# EasyEDA Pro project ProPrj_measure_boardd_2025-02-12.epro

# Schematic Schematic1
Board Name: Board1; Create Date: 2025-02-12; Page Name: P1; Project Name: measure_boardd; Schematic Name: Schematic1; Update Date: 2025-02-12; Company: EasyEDA.com; Page Size: A4; Version: V1.0
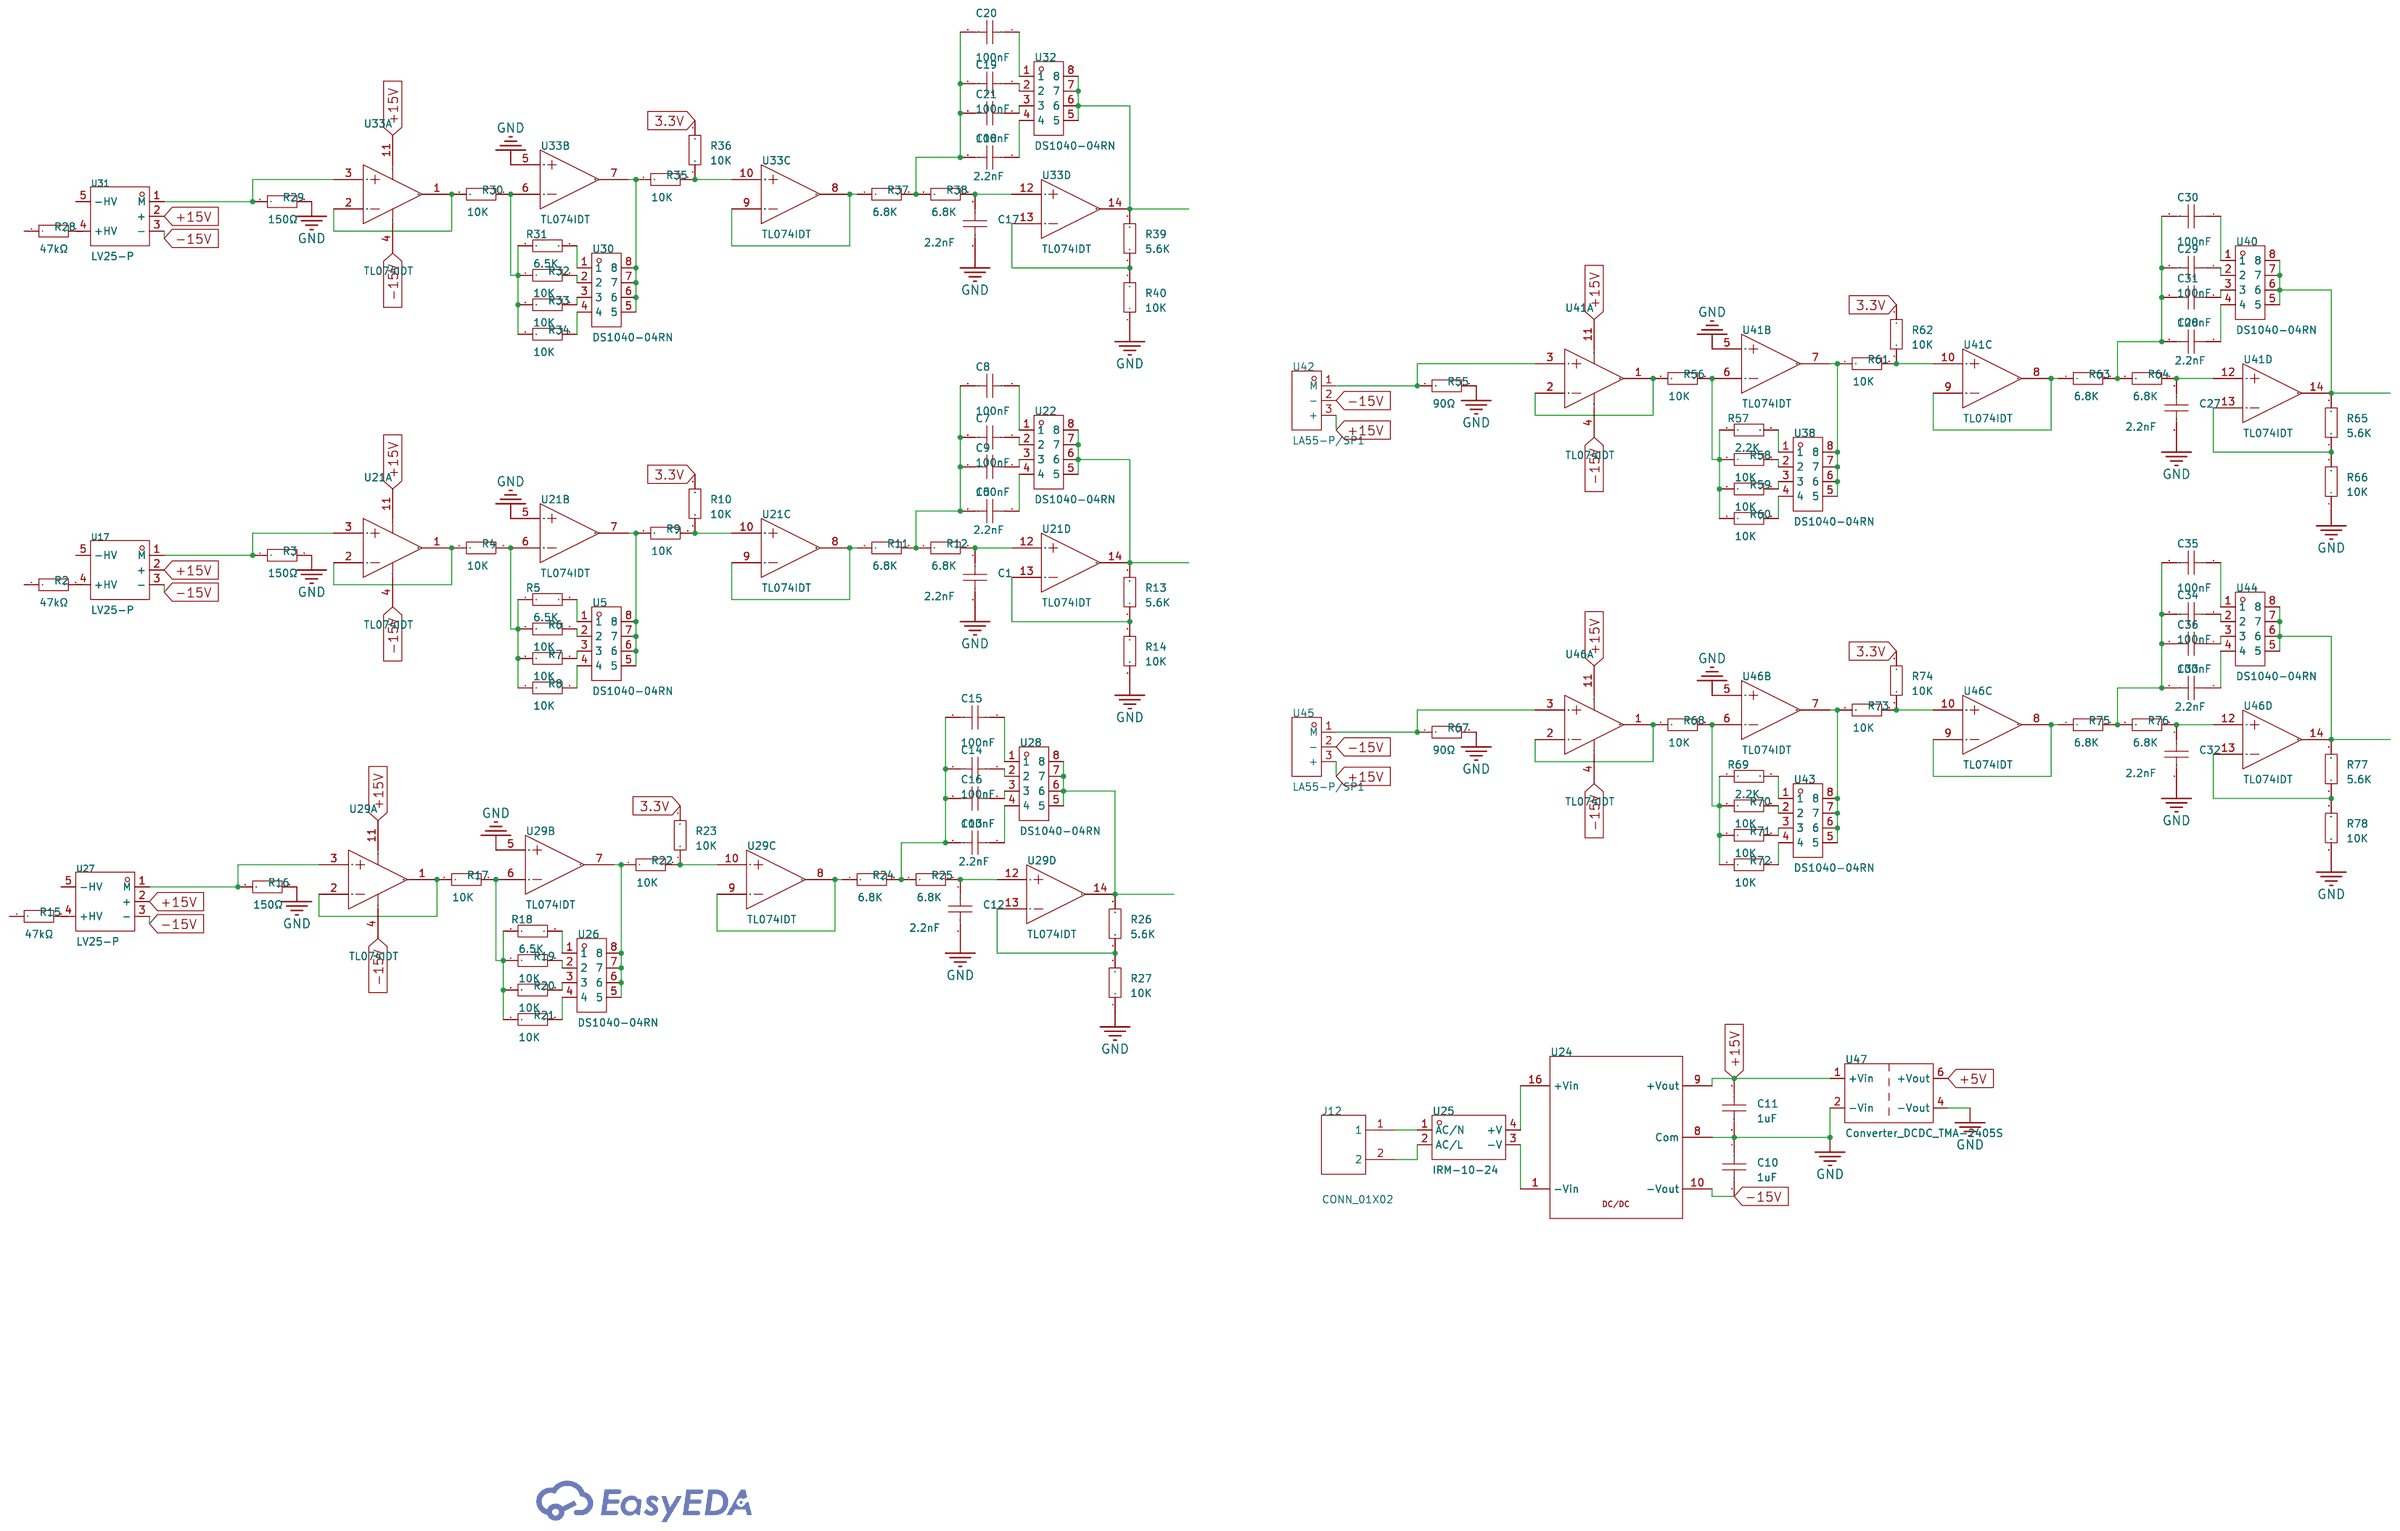
[diagram p0: schematic sheet]

## Parts
C1  2.2nF  [C0805]
C5  2.2nF  [C0805]
C7  100nF  [C0805]
C8  100nF  [C0805]
C9  100nF  [C0805]
C10  1uF  [C0805]
C11  1uF  [C0805]
C12  2.2nF  [C0805]
C13  2.2nF  [C0805]
C14  100nF  [C0805]
C15  100nF  [C0805]
C16  100nF  [C0805]
C17  2.2nF  [C0805]
C18  2.2nF  [C0805]
C19  100nF  [C0805]
C20  100nF  [C0805]
C21  100nF  [C0805]
C27  2.2nF  [C0805]
C28  2.2nF  [C0805]
C29  100nF  [C0805]
C30  100nF  [C0805]
C31  100nF  [C0805]
C32  2.2nF  [C0805]
C33  2.2nF  [C0805]
C34  100nF  [C0805]
C35  100nF  [C0805]
C36  100nF  [C0805]
J12  CONN_01X02  [CONN-TH_2P-P3.81_1727010]
R2  47kΩ  [RES-TH_BD8.0-L24.5-P28.50-D0.8]
R3  150Ω  [R_AXIAL-0.4]
R4  10K  [R0603]
R5  6.5K  [R0603]
R6  10K  [R0603]
R7  10K  [R0603]
R8  10K  [R0603]
R9  10K  [R0603]
R10  10K  [R0603]
R11  6.8K  [R0603]
R12  6.8K  [R0603]
R13  5.6K  [R0603]
R14  10K  [R0603]
R15  47kΩ  [RES-TH_BD8.0-L24.5-P28.50-D0.8]
R16  150Ω  [R_AXIAL-0.4]
R17  10K  [R0603]
R18  6.5K  [R0603]
R19  10K  [R0603]
R20  10K  [R0603]
R21  10K  [R0603]
R22  10K  [R0603]
R23  10K  [R0603]
R24  6.8K  [R0603]
R25  6.8K  [R0603]
R26  5.6K  [R0603]
R27  10K  [R0603]
R28  47kΩ  [RES-TH_BD8.0-L24.5-P28.50-D0.8]
R29  150Ω  [R_AXIAL-0.4]
R30  10K  [R0603]
R31  6.5K  [R0603]
R32  10K  [R0603]
R33  10K  [R0603]
R34  10K  [R0603]
R35  10K  [R0603]
R36  10K  [R0603]
R37  6.8K  [R0603]
R38  6.8K  [R0603]
R39  5.6K  [R0603]
R40  10K  [R0603]
R55  90Ω  [R_AXIAL-0.4]
R56  10K  [R0603]
R57  2.2K  [R0603]
R58  10K  [R0603]
R59  10K  [R0603]
R60  10K  [R0603]
R61  10K  [R0603]
R62  10K  [R0603]
R63  6.8K  [R0603]
R64  6.8K  [R0603]
R65  5.6K  [R0603]
R66  10K  [R0603]
R67  90Ω  [R_AXIAL-0.4]
R68  10K  [R0603]
R69  2.2K  [R0603]
R70  10K  [R0603]
R71  10K  [R0603]
R72  10K  [R0603]
R73  10K  [R0603]
R74  10K  [R0603]
R75  6.8K  [R0603]
R76  6.8K  [R0603]
R77  5.6K  [R0603]
R78  10K  [R0603]
U5  DS1040-04RN  [KEY-TH_DS1040-04RN]
U17  LV25-P  [SENSOR-TH_LV25-P]
U21  TL074IDT  [SOIC-14_L8.7-W3.9-P1.27-LS6.0-BL]  (sections 1,2,3,4)
U22  DS1040-04RN  [KEY-TH_DS1040-04RN]
U24  -  [TEL_8_SERIES]
U25  IRM-10-24  [PWRM-TH_4P-L45.7-W25.4-P8.0]
U26  DS1040-04RN  [KEY-TH_DS1040-04RN]
U27  LV25-P  [SENSOR-TH_LV25-P]
U28  DS1040-04RN  [KEY-TH_DS1040-04RN]
U29  TL074IDT  [SOIC-14_L8.7-W3.9-P1.27-LS6.0-BL]  (sections 1,2,3,4)
U30  DS1040-04RN  [KEY-TH_DS1040-04RN]
U31  LV25-P  [SENSOR-TH_LV25-P]
U32  DS1040-04RN  [KEY-TH_DS1040-04RN]
U33  TL074IDT  [SOIC-14_L8.7-W3.9-P1.27-LS6.0-BL]  (sections 1,2,3,4)
U38  DS1040-04RN  [KEY-TH_DS1040-04RN]
U40  DS1040-04RN  [KEY-TH_DS1040-04RN]
U41  TL074IDT  [SOIC-14_L8.7-W3.9-P1.27-LS6.0-BL]  (sections 1,2,3,4)
U42  LA55-P/SP1  [SENSOR-TH_LAXX-P]
U43  DS1040-04RN  [KEY-TH_DS1040-04RN]
U44  DS1040-04RN  [KEY-TH_DS1040-04RN]
U45  LA55-P/SP1  [SENSOR-TH_LAXX-P]
U46  TL074IDT  [SOIC-14_L8.7-W3.9-P1.27-LS6.0-BL]  (sections 1,2,3,4)
U47  TMA-2405S  [Converter_DCDC:Converter_DCDC_TRACO_TMA-15xxS_24xxS_Single_THT]

## Library data of the parts
C1 C5 C7-C21 C27-C36 = CAP_0805: Supplier Footprint: 0805
J12 = 1727010: Structure:1x2P Pitch:3.81mm Color:Green Mounting Style:Straight Current Rating (Max):13.5A Voltage Rating (Max):300V Number of Pins:2P Number of Rows:1 Wire Gauge - AWG:16~30 Wire Gauge - AWG:16~30 Number of PINs Per Row:2 Operating Temperature Range:- Op; LCSC Part Name: 3.81mm 1x2P 排数:1 每排P数:2 直插; Supplier Part: C89123; Manufacturer: Phoenix Contact(菲尼克斯); Supplier Footprint: 插件,P=3.81mm; JLCPCB Part Class: Extended Part; Datasheet: https://atta.szlcsc.com/upload/public/pdf/source/20161226/1482720147791.pdf; Supplier: LCSC; Structure: 1x2P; Pitch: 3.81mm; Color: Green; Mounting Style: Straight; Current Rating (Max): 13.5A; Voltage Rating (Max): 300V; Number of Pins: 2P; Number of Rows: 1; Wire Gauge - AWG: 16~30; Number of PINs Per Row: 2
R2 R15 R28 = Res_AXIAL-5W: Supplier Footprint: Through
R3 R16 R29 R55 R67 = Res_AXIAL-1/4W: Supplier Footprint: Through
R4-R14 R17-R27 R30-R40 R56-R66 R68-R78 = Res_0603: Supplier Footprint: 0603
U5 U22 U26 U28 U30 U32 U38 U40 U43 U44 = DS1040-04RN: Number of Positions:4Bit Lead Pitch:2.54mm Color:Red; Supplier Part: C3024970; Manufacturer: CONNFLY; Supplier Footprint: 插件; JLCPCB Part Class: Extended Part; Datasheet: https://atta.szlcsc.com/upload/public/pdf/source/20220524/E487E22DEF95345BB2C3C9897C5E0C2D.pdf; Supplier: LCSC; Number of Positions: 4Bit; Lead Pitch: 2.54mm; Color: Red
U17 U27 U31 = LV25-P: Supplier Part: C453476; Manufacturer: LEM(莱姆); Supplier Footprint: 插件; JLCPCB Part Class: Extended Part; Datasheet: https://atta.szlcsc.com/upload/public/pdf/source/20200901/C453476_5BA3BC4F59636857A644FEC5A2FF2FFA.pdf; Supplier: LCSC
U21 U29 U33 U41 U46 = TL074IDT: Number of Circuits:Quad Gain Bandwidth Product(GBP):3MHz Current - Input Bias(Ib):20pA Voltage - Input Offset(Vos):3mV Slew Rate(SR):13V/us Supply Current Per Channel:1.4mA Operating Temperature:-40℃~+105℃ Operating Temperature:-40℃~+105℃; Supplier Part: C107644; Manufacturer: ST(意法半导体); Supplier Footprint: SOIC-14; JLCPCB Part Class: Extended Part; Datasheet: https://atta.szlcsc.com/upload/public/pdf/source/20180511/C79668_B9AF02D8BC6CC04960E26C1CA949D7C5.pdf; Supplier: LCSC; Number of Circuits: Quad; Gain Bandwidth Product(GBP): 3MHz; Current - Input Bias(Ib): 20pA; Voltage - Input Offset(Vos): 3mV; Slew Rate(SR): 13V/us; Supply Current Per Channel: 1.4mA; Operating Temperature: -40℃~+105℃
U24 = TEL_8-2423
U25 = IRM-10-24_C5127809: LCSC Part Name: 10W AC-DC PCB安装绿色电源模块; Supplier Part: C5127809; Manufacturer: MW(明纬); JLCPCB Part Class: Extended Part; Datasheet: https://atta.szlcsc.com/upload/public/pdf/source/20230606/066C111D5DF9FD91D802111A052DE616.pdf; Supplier: LCSC
U42 U45 = LA55-P/SP1: Supplier Part: C454751; Manufacturer: LEM(莱姆); Supplier Footprint: 插件; JLCPCB Part Class: Extended Part; Supplier: LCSC
U47 = Converter_DCDC_TMA-2405S: User doc link: https://www.tracopower.com/products/tma.pdf

## Nets
3.3V: R10.2 R23.2 R36.2 R62.2 R74.2
+5V: U47.6(+Vout)
+15V: C11.1 U17.2(+) U21.11(VCC-) U24.9(+Vout) U27.2(+) U29.11(VCC-) U31.2(+) U33.11(VCC-) U41.11(VCC-) U42.3(+) U45.3(+) U46.11(VCC-) U47.1(+Vin)
-15V: C10.2 U17.3(-) U21.4(VCC+) U24.10(-Vout) U27.3(-) U29.4(VCC+) U31.3(-) U33.4(VCC+) U41.4(VCC+) U42.2(-) U45.2(-) U46.4(VCC+)
GND: C1.2 C10.1 C11.2 C12.2 C17.2 C27.2 C32.2 R3.2 R14.1 R16.2 R27.1 R29.2 R40.1 R55.2 R66.1 R67.2 R78.1 U21.5(2IN+) U24.8(Com) U29.5(2IN+) U33.5(2IN+) U41.5(2IN+) U46.5(2IN+) U47.2(-Vin) U47.4(-Vout)
Net-(C1-1): C1.1 R12.2 U21.12(4IN+)
Net-(C5-1): C5.1 U22.4
Net-(C5-2): C5.2 C7.2 C8.2 C9.2 R11.2 R12.1
Net-(C7-1): C7.1 U22.2
Net-(C8-1): C8.1 U22.1
Net-(C9-1): C9.1 U22.3
Net-(C12-1): C12.1 R25.2 U29.12(4IN+)
Net-(C13-1): C13.1 U28.4
Net-(C13-2): C13.2 C14.2 C15.2 C16.2 R24.2 R25.1
Net-(C14-1): C14.1 U28.2
Net-(C15-1): C15.1 U28.1
Net-(C16-1): C16.1 U28.3
Net-(C17-1): C17.1 R38.2 U33.12(4IN+)
Net-(C18-1): C18.1 U32.4
Net-(C18-2): C18.2 C19.2 C20.2 C21.2 R37.2 R38.1
Net-(C19-1): C19.1 U32.2
Net-(C20-1): C20.1 U32.1
Net-(C21-1): C21.1 U32.3
Net-(C27-1): C27.1 R64.2 U41.12(4IN+)
Net-(C28-1): C28.1 U40.4
Net-(C28-2): C28.2 C29.2 C30.2 C31.2 R63.2 R64.1
Net-(C29-1): C29.1 U40.2
Net-(C30-1): C30.1 U40.1
Net-(C31-1): C31.1 U40.3
Net-(C32-1): C32.1 R76.2 U46.12(4IN+)
Net-(C33-1): C33.1 U44.4
Net-(C33-2): C33.2 C34.2 C35.2 C36.2 R75.2 R76.1
Net-(C34-1): C34.1 U44.2
Net-(C35-1): C35.1 U44.1
Net-(C36-1): C36.1 U44.3
Net-(J12-1): J12.1 U25.1(AC/N)
Net-(J12-2): J12.2 U25.2(AC/L)
Net-(R2-2): R2.2 U17.4(+HV)
Net-(R3-1): R3.1 U17.1(M) U21.3(1IN+)
Net-(R4-1): R4.1 U21.1(1OUT) U21.2(1IN-)
Net-(R4-2): R4.2 R5.1 R6.1 R7.1 R8.1 U21.6(2IN-)
Net-(R5-2): R5.2 U5.1
Net-(R6-2): R6.2 U5.2
Net-(R7-2): R7.2 U5.3
Net-(R8-2): R8.2 U5.4
Net-(R9-1): R9.1 U5.5 U5.6 U5.7 U5.8 U21.7(2OUT)
Net-(R9-2): R9.2 R10.1 U21.10(3IN+)
Net-(R11-1): R11.1 U21.8(3OUT) U21.9(3IN-)
Net-(R13-1): R13.1 R14.2 U21.13(4IN-)
Net-(R13-2): R13.2 U21.14(4OUT) U22.5 U22.6 U22.7 U22.8
Net-(R15-2): R15.2 U27.4(+HV)
Net-(R16-1): R16.1 U27.1(M) U29.3(1IN+)
Net-(R17-1): R17.1 U29.1(1OUT) U29.2(1IN-)
Net-(R17-2): R17.2 R18.1 R19.1 R20.1 R21.1 U29.6(2IN-)
Net-(R18-2): R18.2 U26.1
Net-(R19-2): R19.2 U26.2
Net-(R20-2): R20.2 U26.3
Net-(R21-2): R21.2 U26.4
Net-(R22-1): R22.1 U26.5 U26.6 U26.7 U26.8 U29.7(2OUT)
Net-(R22-2): R22.2 R23.1 U29.10(3IN+)
Net-(R24-1): R24.1 U29.8(3OUT) U29.9(3IN-)
Net-(R26-1): R26.1 R27.2 U29.13(4IN-)
Net-(R26-2): R26.2 U28.5 U28.6 U28.7 U28.8 U29.14(4OUT)
Net-(R28-2): R28.2 U31.4(+HV)
Net-(R29-1): R29.1 U31.1(M) U33.3(1IN+)
Net-(R30-1): R30.1 U33.1(1OUT) U33.2(1IN-)
Net-(R30-2): R30.2 R31.1 R32.1 R33.1 R34.1 U33.6(2IN-)
Net-(R31-2): R31.2 U30.1
Net-(R32-2): R32.2 U30.2
Net-(R33-2): R33.2 U30.3
Net-(R34-2): R34.2 U30.4
Net-(R35-1): R35.1 U30.5 U30.6 U30.7 U30.8 U33.7(2OUT)
Net-(R35-2): R35.2 R36.1 U33.10(3IN+)
Net-(R37-1): R37.1 U33.8(3OUT) U33.9(3IN-)
Net-(R39-1): R39.1 R40.2 U33.13(4IN-)
Net-(R39-2): R39.2 U32.5 U32.6 U32.7 U32.8 U33.14(4OUT)
Net-(R55-1): R55.1 U41.3(1IN+) U42.1(M)
Net-(R56-1): R56.1 U41.1(1OUT) U41.2(1IN-)
Net-(R56-2): R56.2 R57.1 R58.1 R59.1 R60.1 U41.6(2IN-)
Net-(R57-2): R57.2 U38.1
Net-(R58-2): R58.2 U38.2
Net-(R59-2): R59.2 U38.3
Net-(R60-2): R60.2 U38.4
Net-(R61-1): R61.1 U38.5 U38.6 U38.7 U38.8 U41.7(2OUT)
Net-(R61-2): R61.2 R62.1 U41.10(3IN+)
Net-(R63-1): R63.1 U41.8(3OUT) U41.9(3IN-)
Net-(R65-1): R65.1 R66.2 U41.13(4IN-)
Net-(R65-2): R65.2 U40.5 U40.6 U40.7 U40.8 U41.14(4OUT)
Net-(R67-1): R67.1 U45.1(M) U46.3(1IN+)
Net-(R68-1): R68.1 U46.1(1OUT) U46.2(1IN-)
Net-(R68-2): R68.2 R69.1 R70.1 R71.1 R72.1 U46.6(2IN-)
Net-(R69-2): R69.2 U43.1
Net-(R70-2): R70.2 U43.2
Net-(R71-2): R71.2 U43.3
Net-(R72-2): R72.2 U43.4
Net-(R73-1): R73.1 U43.5 U43.6 U43.7 U43.8 U46.7(2OUT)
Net-(R73-2): R73.2 R74.1 U46.10(3IN+)
Net-(R75-1): R75.1 U46.8(3OUT) U46.9(3IN-)
Net-(R77-1): R77.1 R78.2 U46.13(4IN-)
Net-(R77-2): R77.2 U44.5 U44.6 U44.7 U44.8 U46.14(4OUT)
Net-(U24-1): U24.1(-Vin) U25.3(-V)
Net-(U24-16): U24.16(+Vin) U25.4(+V)

Not connected (* = marked no-connect by the designer): R2 1; R15 1; R28 1; U17 5(-HV); U27 5(-HV); U31 5(-HV)
